# Altium schematic sheet USB Hub IC.SchDoc
size 420 x 297 mm; SheetNumber: 2; SheetTotal: 7
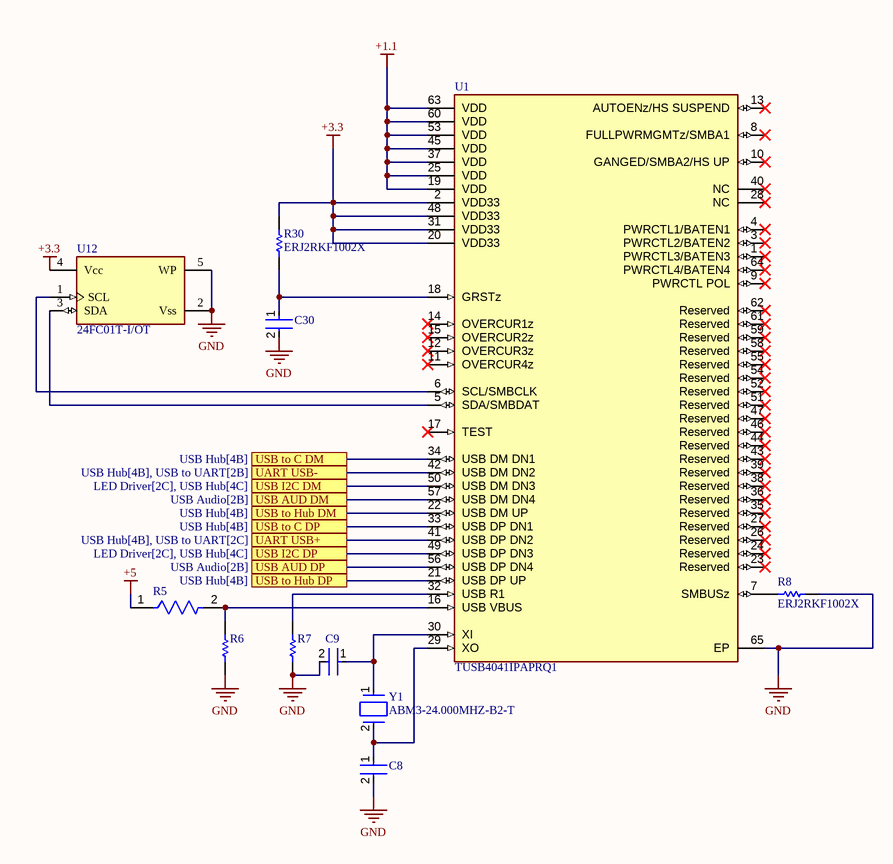
[diagram p0: USB Hub IC.SchDoc]

## Parts
C8  GJM1555C1H180JB01D  [FP-GJM155-0_05-IPC_B]  (value not drawn)
C9  GJM1555C1H180JB01D  [FP-GJM155-0_05-IPC_B]  (value not drawn)
C30  GRM1555C1E103GE01D  [FP-GRM155-0_15-IPC_B]  (value not drawn)
R5  ERJ-2RKF9092X  [FP-ERJ2RK-MFG]  (value not drawn)
R6  ERJ2RKF1002X  [RESC1005X40X25LL05T05]  (value not drawn)
R7  ERA-3AED9531V  [RESC1608X55X30ML20T20]  (value not drawn)
R8  ERJ2RKF1002X  [RESC1005X40X25LL05T05]
R30  ERJ2RKF1002X  [RESC1005X40X25LL05T05]
U1  TUSB4041IPAPRQ1  [FP-PAP0064K-MFG]
U12  24FC01T-I/OT  [FP-C04-091-OT-MFG]
Y1  ABM3-24.000MHZ-B2-T  [FP-ABM3-MFG]

## Ports
UART USB+ (see USB Hub[4B], USB to UART[2C]), UART USB- (see USB Hub[4B], USB to UART[2B]), USB AUD DM (see USB Audio[2B]), USB AUD DP (see USB Audio[2B]), USB I2C DM (see LED Driver[2C], USB Hub[4C]), USB I2C DP (see LED Driver[2C], USB Hub[4C]), USB to C DM (see USB Hub[4B]), USB to C DP (see USB Hub[4B]), USB to Hub DM (see USB Hub[4B]), USB to Hub DP (see USB Hub[4B])

## Nets
+1.1: U1.19(VDD) U1.25(VDD) U1.37(VDD) U1.45(VDD) U1.53(VDD) U1.60(VDD) U1.63(VDD)
+3.3: R30.2 U1.2(VDD33) U1.20(VDD33) U1.31(VDD33) U1.48(VDD33) U12.4(Vcc)
+5: R5.1
GND: C8.2 C9.2 C30.2 R6.1 R7.1 R8.1 U1.65(EP) U12.2(Vss) U12.5(WP)
UART USB+: U1.41(USB_DP_DN2) ; port UART USB+
UART USB-: U1.42(USB_DM_DN2) ; port UART USB-
USB AUD DM: U1.57(USB_DM_DN4) ; port USB AUD DM
USB AUD DP: U1.56(USB_DP_DN4) ; port USB AUD DP
USB I2C DM: U1.50(USB_DM_DN3) ; port USB I2C DM
USB I2C DP: U1.49(USB_DP_DN3) ; port USB I2C DP
USB to C DM: U1.34(USB_DM_DN1) ; port USB to C DM
USB to C DP: U1.33(USB_DP_DN1) ; port USB to C DP
USB to Hub DM: U1.22(USB_DM_UP) ; port USB to Hub DM
USB to Hub DP: U1.21(USB_DP_UP) ; port USB to Hub DP
NetC8_1: C8.1 U1.29(XO) Y1.2
NetC9_1: C9.1 U1.30(XI) Y1.1
NetC30_1: C30.1 R30.1 U1.18(GRSTz)
NetR5_2: R5.2 R6.2 U1.16(USB_VBUS)
NetR7_2: R7.2 U1.32(USB_R1)
NetR8_2: R8.2 U1.7(SMBUSz)
NetU1_5: U1.5(SDA/SMBDAT) U12.3(SDA)
NetU1_6: U1.6(SCL/SMBCLK) U12.1(SCL)

Not connected (* = marked no-connect by the designer): U1 1(PWRCTL3/BATEN3)* 3(PWRCTL2/BATEN2)* 4(PWRCTL1/BATEN1)* 8(FULLPWRMGMTz/SMBA1)* 9(PWRCTL_POL)* 10(GANGED/SMBA2/HS_UP)* 11(OVERCUR4z)* 12(OVERCUR3z)* 13(AUTOENz/HS_SUSPEND)* 14(OVERCUR1z)* 15(OVERCUR2z)* 17(TEST)* 23(Reserved)* 24(Reserved)* 26(Reserved)* 27(Reserved)* 28(NC)* 35(Reserved)* 36(Reserved)* 38(Reserved)* 39(Reserved)* 40(NC)* 43(Reserved)* 44(Reserved)* 46(Reserved)* 47(Reserved)* 51(Reserved)* 52(Reserved)* 54(Reserved)* 55(Reserved)* 58(Reserved)* 59(Reserved)* 61(Reserved)* 62(Reserved)* 64(PWRCTL4/BATEN4)*

## Notes on the sheet
- CREATIVE COMMONS
- PUBLIC LICENSE:
- BARKOUR ROBOT
- CC BY-NC 4.0
- APPROVED
- DWG NO
- GOOGLE LLC
- FILE
- RELEASED
- 2024/05/09
- SIZE
- 1600 AMPHITHEATRE PARKWAY
- MOUNTAIN VIEW CA 94043
- A3
- SHEET
- OF
- THIS DESIGN IS BEING PROVIDED  FOR NON-COMMERCIAL USE ONLY. THE USE OF =SCIENTIST_NAME_POSSESSIVE NAME IN CONNECTION WITH THE DESIGN IS NOT INTENDED TO IMPLY THAT =SCIENTIST_NAME SPONSORS OR ENDORSES THE DESIGN, GOOGLE LLC, OR ANY OF GOOGLE LLC'S PRODUCTS OR SERVICES.

## Library data of the parts
C8 C9 = CMP-2008-03807-2: Multi-Layer Ceramic Capacitor 18pF C0G  ±5% 0402 Paper T/R; Voltage: 50V; Radiation Hardening: No; Capacitance: 18pF; Depth: 0.5mm; Voltage Rating: 50V; Case/Package: 0402; Tolerance: 5%; Packaging: Tape and Reel; Height: 0.5mm; Case Code (Imperial): 0402; Width: 0.02inch; Lead Free: Lead Free; Dielectric: C0G; Package Quantity: 1; Max Operating Temperature: 125°C; Thickness: 0.022inch; Termination: SMD/SMT; Length: 1mm; Min Operating Temperature: -55°C; Mount: Surface Mount; Voltage Rating (DC): 50V; Case Code (Metric): 1005
C30 = CMP-06035-007392-1: Chip Multilayer Ceramic Capacitors for General Purpose, 0402, 10000pF, C0G, 30ppm/°C, 2%, 25V
R5 = CMP-1011-00731-3: RES SMD 90.9K OHM 1% 1/10W 0402; Resistance: 90.9kR; Max Power Dissipation: 100mW; Voltage Rating: 50V; Temperature Coefficient: 100ppm/°C; Military Standard: Not; Min Operating Temperature: -55°C; Resistor Type: Thick Film; Case/Package: 0402; Features: Automotive AEC-Q200; Package Quantity: 1; Packaging: Tape and Reel; Resistance Tolerance: 1%; Max Operating Temperature: 155°C; Construction: Rectangular; REACH SVHC: No SVHC; Series: ERJ; Termination: SMD/SMT; RoHS Compliant: Yes; Contact Plating: Tin; Width: 0.02inch; Number of Terminations: 2; Power Rating: 100mW; Height: 0.016inch; Voltage Rating (DC): 50V; Mount: Surface Mount; Case Code (Metric): 1005; Length: 1mm; Depth: 0.5mm; Case Code (Imperial): 0402; Tolerance: 1%
R6 R8 R30 = CMP-2000-07588-1: Chip Resistor, 10 KOhm, +/- 1%, 0.1 W, -55 to 155 degC, 0402 (1005 Metric), RoHS, Tape and Reel; Manufacturer: Panasonic; Power Rating: 100mW; Voltage Rating: 50V; Resistance: 10KOhm; Case\/Package: 0402; Temperature Coefficient: 100ppm\/degreesC; RoHSCompliant: True; Lead Free: LeadFree; Package Quantity: 1; Contact Plating: Tin; Length: 1mm; Radiation Hardening: No; REACH SVHC: NoSVHC; Max Operating Temperature: 155degC; Depth: 0.5mm; Case Code (Imperial): 0402; Military Standard: Not; Package Description: 2-Pin Surface Mount Device, Body 1 x 0.5 mm; Termination: SMD/SMT; Case Code (Metric): 1005; Height: 0.35mm; Packaging: TapeandReel; Voltage Rating (DC): 50V; Package Reference: 402; Number of Pins: 2; Tolerance: 1%; Mounting Technology: SurfaceMount; Width: 0.02inch; Mount: SurfaceMount; Datasheet URL: https://industrial.panasonic.com/cdbs/www-data/pdf/RDA0000/AOA0000C304.pdf; Composition: ThickFilm; Datasheet Version: 02/2017; Manufacturer URL: http://www.panasonic.com/; Max Power Dissipation: 100mW; Number of Terminations: 2; Min Operating Temperature: -55degC
R7 = CMP-2000-00160-1: Manufacturer: Panasonic; Part Number: ERA-3AED9531V
U1 = CMP-04877-000003-1: IC USB 2.0 4PORT HUB 64HTQFP; Manufacturer: Texas Instruments; Interface: I2C,USB,SMBus; Max Supply Voltage: 3.6V; Nominal Supply Current: 15uA; Standoff Height: 0.05mm; Min Supply Voltage: 0.99V; Usb Standard: USB 2.0; Number Of Ports: 4; Max Junction Temp: +105°C; Data Rate: 480Mbits/s; Temperature: -40°C to +85°C; ComponentLink2Description: Datasheet; Category: IC; Device Class L3: USB Interface ICs; Device Class L2: Interface ICs; Height: 1.2mm; ComponentLink2URL: http://www.ti.com/lit/ds/symlink/tusb4041i.pdf; Ipc Land Pattern Name: QFP50P1200X1200X120-64; Temperature Range High: +85°C; Lead Free: Yes; Manufacturer Part Number: TUSB4041IPAPR; Temperature Range Low: -40°C; RoHS: TRUE; Digikey Description: IC USB 2.0 4PORT HUB 64HTQFP; Device Class L1: Integrated Circuits (ICs); Ambient Temperature Range Low: -40°C; Automotive: No; Package: PAP0064K; Octopart: https://octopart.com/tusb4041ipapr-texas+instruments-61734371; Ambient Temperature Range High: +85°C
U12 = CMP-06313-000176-1: IC EEPROM 1KBIT I2C 1MHZ SOT23-5; Memory Size: 1Kb; Access Time: 450ns; Memory Type: Non-Volatile; Case/Package: SOT-23-5; Packaging: Cut Tape; Max Operating Temperature: 85°C; Min Operating Temperature: -40°C; Mount: Surface Mount; Frequency: 1MHz; Series: -; RoHS Compliant: Yes
Y1 = CMP-27762-013604-1: Crystal 24MHz ±20ppm 18pF SMD-2 5mm x 3.2mm; Series Resistance: 50R; ESR (Equivalent Series Resistance): 30R; Frequency Stability: 50ppm; Max Operating Temperature: 70°C; Resistor Type: Ceramic; Series: ABM3; REACH SVHC: Yes; Min Operating Temperature: -20°C; Lead Free: Lead Free; Number of Pins: 2; Packaging: Tape and Reel; Termination: SMD/SMT; Length: 5mm; Depth: 3.2mm; Package Quantity: 1000; Case/Package: CSMD; Accuracy: 20ppm; Height: 0.051inch; Mount: Surface Mount; Width: 3.2mm; Tolerance: 20ppm; Frequency Tolerance: 20ppm; Load Capacitance: 18pF; Operating Frequency: 24 MHz; Frequency: 24MHz; Radiation Hardening: No